# Altium schematic sheet DCDC.SchDoc
size A4; SheetNumber: 2; SheetTotal: 3
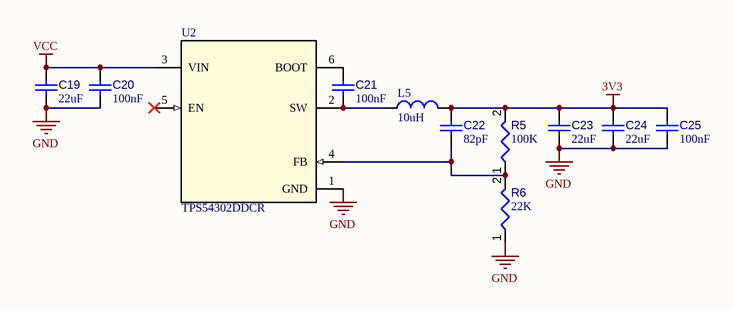
[diagram p0: DCDC.SchDoc]

## Parts
C19  value 22uF  [CAPC2012X14L]  (hidden comment: CL21A226MAQNNNE)
C20  value 100nF  [CAPC1005X55X25LL05T05]  (hidden comment: CL05B104KB5NNNC)
C21  value 100nF  [CAPC1005X55X25LL05T05]  (hidden comment: CL05B104KB5NNNC)
C22  value 82pF  [CAPC1005X55X25LL05T05]  (hidden comment: CL05C820JB5NNNC)
C23  value 22uF  [CAPC1608X87X35LL15T15]  (hidden comment: CL10A226MP8NUNE)
C24  value 22uF  [CAPC1608X87X35LL15T15]  (hidden comment: CL10A226MP8NUNE)
C25  value 100nF  [CAPC1608X87X35LL15T15]  (hidden comment: CL10B104JB8NNNC)
L5  value 10uH  [INDP5050X42L]  (hidden comment: SWPA5040S100MT)
R5  value 100K  [RESC1005X40X25LL05T05]  (hidden comment: 100K 0402)
R6  value 22K  [RESC1005X40X25LL05T05]  (hidden comment: 22K 0402)
U2  TPS54302DDCR  [TSOP-6_L]

## Nets
3V3: C22.2 C23.2 C24.2 C25.2 L5.2 R5.2
GND: C19.1 C20.1 C23.1 C24.1 C25.1 R6.1 U2.1(GND)
VCC: C19.2 C20.2 U2.3(VIN)
NetC21_1: C21.1 L5.1 U2.2(SW)
NetC21_2: C21.2 U2.6(BOOT)
NetC22_1: C22.1 R5.1 R6.2 U2.4(FB)

Not connected (* = marked no-connect by the designer): U2 5(EN)*

## Library data of the parts
C19 = CL21A226MAQNNNE: Non-Polarized Capacitor Symbol; Tolerance: 20%; Voltage Rating: 25V; Capacitor Type: Ceramic; Type: X5R; Case/Size Code: 0805
C20 C21 = CL05B104KB5NNNC: Non-Polarized Capacitor Symbol; Tolerance: 10%; Voltage Rating: 50V; Capacitor Type: Ceramic; Type: X7R; Case/Size Code: 0402
C22 = CL05C820JB5NNNC: Non-Polarized Capacitor Symbol; Tolerance: 5%; Voltage Rating: 50V; Capacitor Type: Ceramic; Type: C0G; Case/Size Code: 0402
C23 C24 = CL10A226MP8NUNE: Non-Polarized Capacitor Symbol; Tolerance: 20%; Voltage Rating: 10V; Capacitor Type: Ceramic; Type: X5R; Case/Size Code: 0603
C25 = CL10B104JB8NNNC: Non-Polarized Capacitor Symbol; Tolerance: 5%; Voltage Rating: 50V; Capacitor Type: Ceramic; Type: X7R; Case/Size Code: 0603
L5 = SWPA5040S100MT: Case/Size Code: 5040; Pins: 2
R5 = 100K 0402: Chip Resistor, 100K Ohm, +/- 1%, 0.063 W, -55 to 155 degC, 0402 (1005 Metric); Case/Size Code: 0402; Pins: 2
R6 = 22K 0402: 0402 Chip Resistor; Case/Size Code: 0402; Pins: 2
U2 = TPS54302DDCR: 4.5-V to 28-V Input, 3-A Output, EMI-Friendly Synchronous Step-Down Converter; Package: TSOP-6